# Altium schematic sheet Power_Supply_3.SchDoc
size A4; CompanyName: Technische Hochschule Nürnberg Georg Simon Ohm; Organization: UltraZohm; Address1: Kesslerplatz 12; Address2: 90489 Nürnberg; Address3: GERMANY; DocumentNumber: 12; SheetNumber: 12; SheetTotal: 12; Website: www.ultrazohm.com
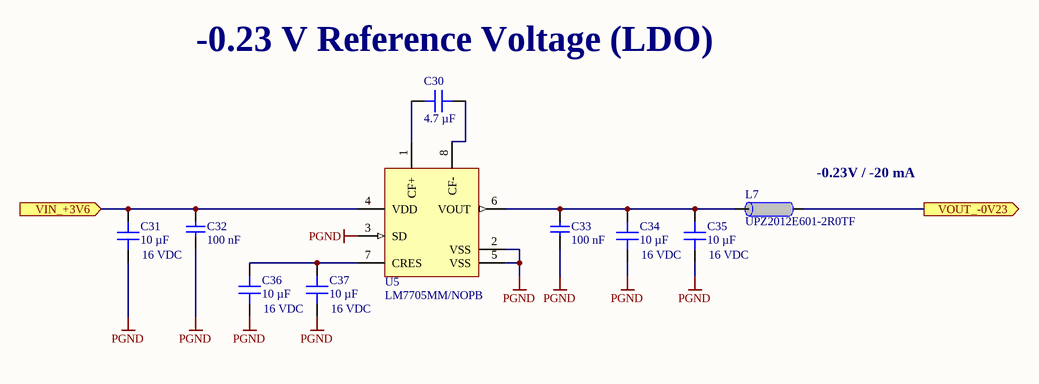
[diagram p0: Power_Supply_3.SchDoc]

## Parts
C30  4.7 µF  [C_0805]
C31  10 µF  Voltage Rating: 16 VDC  [C_0603_TE]
C32  100 nF  [C_0603_TE]
C33  100 nF  [C_0603_TE]
C34  10 µF  Voltage Rating: 16 VDC  [C_0603_TE]
C35  10 µF  Voltage Rating: 16 VDC  [C_0603_TE]
C36  10 µF  Voltage Rating: 16 VDC  [C_0603_TE]
C37  10 µF  Voltage Rating: 16 VDC  [C_0603_TE]
L7  UPZ2012E601-2R0TF  [INDC2012X92N_V]
U5  LM7705MM/NOPB  [MSOP-8_DGK0008A_L]

## Ports
VIN_+3V6 (in), VOUT_-0V23 (out)

## Nets
PGND: C31.1 C32.1 C33.1 C34.1 C35.1 C36.1 C37.1 U5.2(VSS) U5.3(SD) U5.5(VSS)
VIN_+3V6: C31.2 C32.2 U5.4(VDD) ; port VIN_+3V6
VOUT_-0V23: L7.1 ; port VOUT_-0V23
NetC30_1: C30.1 U5.1(CF+)
NetC30_2: C30.2 U5.8(CF-)
NetC33_2: C33.2 C34.2 C35.2 L7.2 U5.6(VOUT)
NetC36_2: C36.2 C37.2 U5.7(CRES)

## Notes on the sheet
- (near C30) -0.23 V Reference Voltage (LDO)
- (near L7) -0.23V / -20 mA
- Title
- Revision:
- Design Engineer:
- Date:
- Project:
- Sheet
- of

## Library data of the parts
C30 = CL21A475KAQNNNE: 25V 4.7uF X5R ±10% 0805  Multilayer Ceramic Capacitors MLCC - SMD/SMT ROHS; Manufacturer: Samsung Electro-Mechanics; Voltage Rating: 25 VDC; Created from: AGeiger; Manufacturer Part Number: CL21A475KAQNNNE; PartID: 113; Created On: 20.11.2022 14:23:36; ComponentLink1Description: Datasheet; ComponentLink1URL: https://datasheet.lcsc.com/lcsc/1810261822_Samsung-Electro-Mechanics-CL21A475KAQNNNE_C1779.pdf; Component Type: Capacitor 0805; Device Package: 0805; Last Updated: 20.11.2022 14:23:36; Mounting Type: SMD; Operating Temperature: -55 to +85°C; Series: X5R; Supplier 1: LCSC; Supplier Part Number 1: C1779; Type: Capacitor; Tolerance: 10 %; Value: 4.7 µF; Live Cycle Status: 1; LCSC Part Number: C1779
C31 C34-C37 = CL10A106MO8NQNC: Capacitor 0603, 16 VDC, 10 µF, X5R; Manufacturer: Samsung Electro-Mechanics; Tolerance: 20 %; Created from: AGeiger; Manufacturer Part Number: CL10A106MO8NQNC; PartID: 101; Created On: 22.08.2022 13:56:44; ComponentLink1Description: Datasheet; ComponentLink1URL: https://datasheet.lcsc.com/lcsc/1810261909_Samsung-Electro-Mechanics-CL10A106MO8NQNC_C92487.pdf; Component Type: Capacitor 0603; Device Package: 0603; Last Updated: 19.11.2024 12:34:06; Mounting Type: SMD; Operating Temperature: -55 - 85°C; Supplier 1: LCSC; Supplier Part Number 1: C92487; Type: Capacitor; Value: 10 µF; Live Cycle Status: 1; LCSC Part Number: C92487; Series: X5R
C32 C33 = UZgen_C_0603_100nF_50V_X7R: Generic capacitor; Manufacturer: UZgen; Tolerance: 10 %; Created from: AGeiger; Voltage: 50V; Manufacturer Part Number: UZgen_C_0603_100nF_50V_X7R; PartID: 1; Created On: 02.07.2024 14:42:23; Device Package: 0603; Last Updated: 08.08.2024 15:01:15; Mounting Type: SMD; Value: 100 nF; Technology: X7R
L7 = UPZ2012E601-2R0TF: 2A 1 90mΩ 600Ω@100MHz ±25% 0805  Ferrite Beads ROHS; Manufacturer: Sunlord; Value: 90 Ohm; Created from: AGeiger; Manufacturer Part Number: UPZ2012E601-2R0TF; PartID: 11; Created On: 03.09.2022 16:57:01; ComponentLink1Description: Datasheet; ComponentLink1URL: https://datasheet.lcsc.com/lcsc/2110091730_Sunlord-UPZ2012E601-2R0TF_C98308.pdf; Component Type: Ferrite Beads; Device Package: 0805; Last Updated: 03.09.2022 17:01:04; Mounting Type: SMD; Operating Temperature: -55 - 125 °C; Supplier 1: LCSC; Supplier Part Number 1: C98308; Type: Ferrite Bead; DC current: 2 A; Live Cycle Status: 1; LCSC Part Number: C98308
U5 = LM7705MM/NOPB: Low-Noise Negative Bias Generator; MF: Texas Instruments; OperationTempMin: -40°C; OperationTempMax: +125°C; Value: -0.23V; Created from: AGeiger; ComponentLink1Description: Datasheet; ComponentLink1URL: https://www.ti.com/lit/ds/symlink/lm7705.pdf?ts=1668951598020; Package: VSSOP-8 (DGK0008A); MPN: LM7705MM/NOPB; Manufacturer Part Number: LM7705MM/NOPB; PartID: 22; Created On: 20.11.2022 14:06:38; Component Type: Switched voltage inverter; Device Package: MSOP-8; Last Updated: 20.11.2022 14:06:38; Manufacturer: Texas Instruments; Mounting Type: SMD; Operating Temperature: -40 to +125 °C; Supplier 1: LCSC; Supplier Part Number 1: C129980; Type: Step-down; Live Cycle Status: 1; LCSC Part Number: C129980; Stock number: not stored